# Altium project pca10184.PrjPcb (part 2 of 5)

## Sheet pca10184_power_supply.SchDoc: =ProductName + ' - Power Supply'
size A3; Author: GETR; CompanyName: Nordic Semiconductor; DrawnBy: GETR; DocumentNumber: 6; Revision: 0.7.0; SheetNumber: 6; SheetTotal: 9
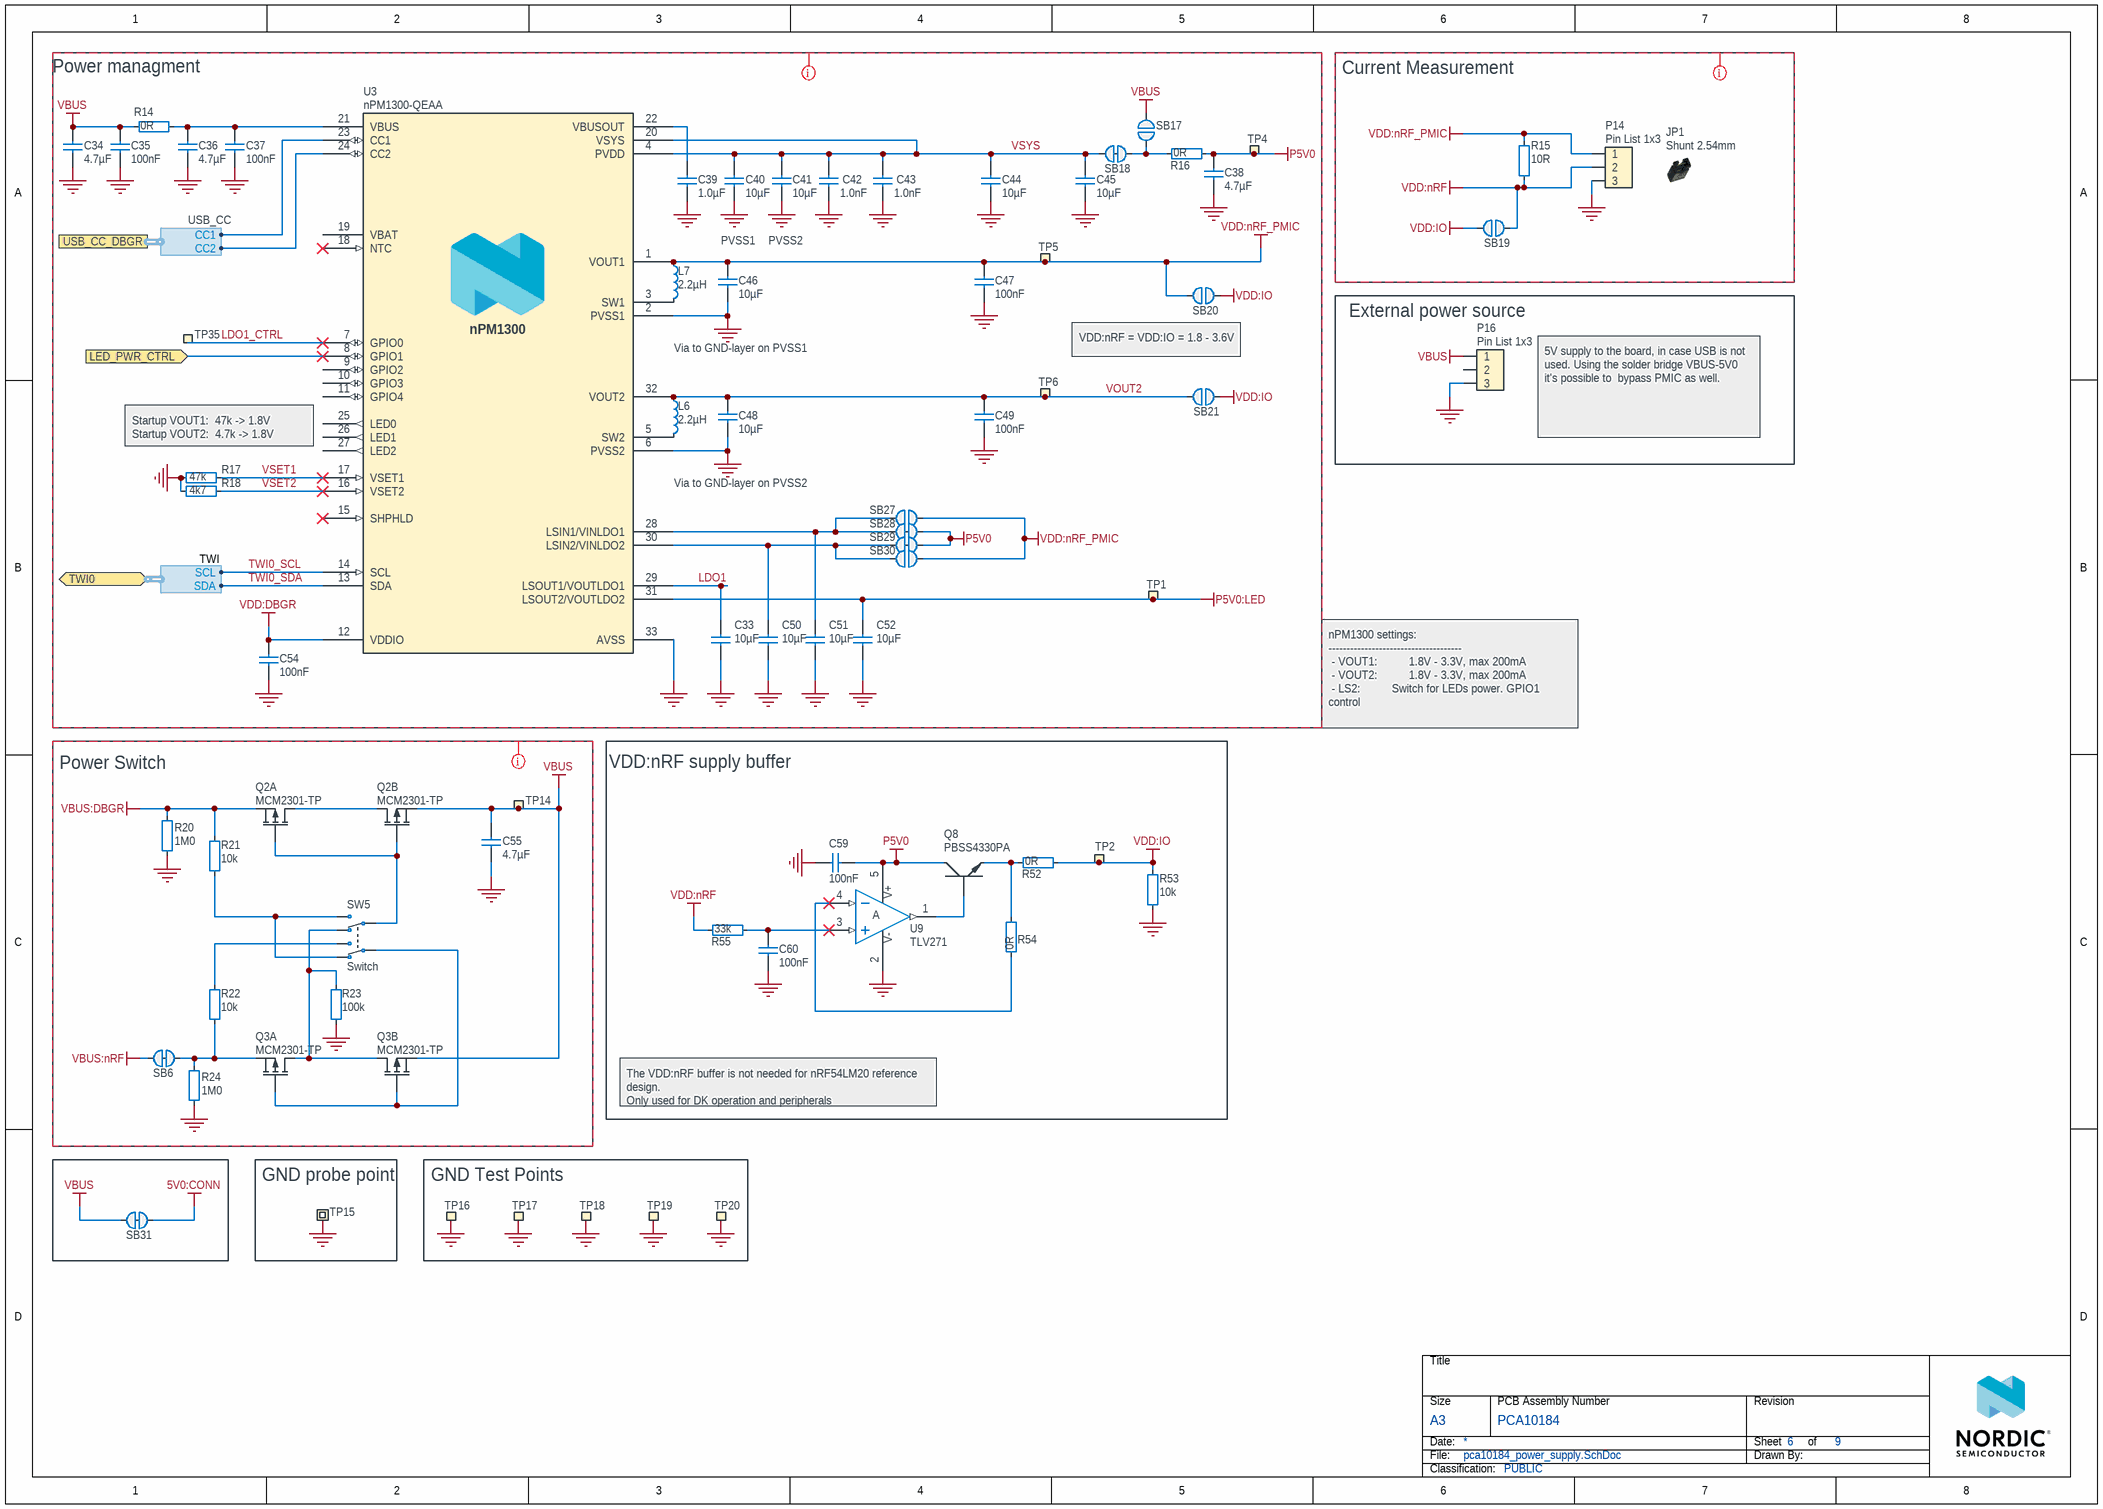
[diagram p2: pca10184_power_supply.SchDoc]

### Parts
C33  10µF  [CAPC1608X06L]
C34  4.7µF  [CAPC1005X04L_C2]
C35  100nF  [CAPC0603X03L_C]
C36  4.7µF  [CAPC1005X04L_C2]
C37  100nF  [CAPC0603X03L_C]
C38  4.7µF  [CAPC1005X04L_C2]
C39  1.0µF  [CAPC1005X04L]
C40  10µF  [CAPC1608X06L]
C41  10µF  [CAPC1608X06L]
C42  1.0nF  [CAPC0603X03L_C]
C43  1.0nF  [CAPC0603X03L_C]
C44  10µF  [CAPC1608X06L]
C45  10µF  [CAPC1608X06L]
C46  10µF  [CAPC1608X06L]
C47  100nF  [CAPC0603X03L_C]
C48  10µF  [CAPC1608X06L]
C49  100nF  [CAPC0603X03L_C]
C50  10µF  [CAPC1608X06L]
C51  10µF  [CAPC1608X06L]
C52  10µF  [CAPC1608X06L]
C54  100nF  [CAPC0603X03L_C]
C55  4.7µF  [CAPC1608X06L]
C59  100nF  [CAPC0603X03L_C]
C60  100nF  [CAPC0603X03L_C]
JP1  Shunt 2.54mm  [Shunt_2.54mm_Vertical]
L6  2.2µH  [INDC2016X10N]
L7  2.2µH  [INDC2016X10N]
P14  Pin List 1x3  [LIST_1x3_SMD]
P16  Pin List 1x3  [LIST_1x3_SMD]
Q2  MCM2301-TP  [DFN65P200X200X80_HS-6N]  (parts A,B of 2)
Q3  MCM2301-TP  [DFN65P200X200X80_HS-6N]  (parts A,B of 2)
Q8  PBSS4330PA  [DFN105P200X65-3N_v2]
R14  0R  [RESC1005X04L]
R15  10R  [RESC1005X04L]
R16  0R  [RESC1005X04L]
R17  47k  [RESC0603X03L_C]
R18  4k7  [RESC0603X03L_C]
R20  1M0  [RESC0603X03L_C]
R21  10k  [RESC0603X03L_C]
R22  10k  [RESC0603X03L_C]
R23  100k  [RESC0603X03L_C]
R24  1M0  [RESC0603X03L_C]
R52  0R  [RESC0603X03L_C]
R53  10k  [RESC0603X03L_C]
R54  0R  [RESC0603X03L_C]
R55  33k  [RESC0603X03L_C]
SB6  Solderbridge  [Solderbridge_Shorted_Power]  (value not drawn)  (net tie, no BOM)
SB17  Solderbridge  [Solderbridge]  (value not drawn)  (no BOM)
SB18  Solderbridge  [Solderbridge_Shorted_Power]  (value not drawn)  (net tie, no BOM)
SB19  Solderbridge  [Solderbridge]  (value not drawn)  (no BOM)
SB20  Solderbridge  [Solderbridge]  (value not drawn)  (no BOM)
SB21  Solderbridge  [Solderbridge]  (value not drawn)  (no BOM)
SB27  Solderbridge  [Solderbridge]  (value not drawn)  (no BOM)
SB28  Solderbridge  [Solderbridge_Shorted]  (value not drawn)  (net tie, no BOM)
SB29  Solderbridge  [Solderbridge_Shorted]  (value not drawn)  (net tie, no BOM)
SB30  Solderbridge  [Solderbridge]  (value not drawn)  (no BOM)
SB31  Solderbridge  [Solderbridge_Shorted_Power]  (value not drawn)  (net tie, no BOM)
SW5  Switch  [JS102011JAQN]
TP1  Ø1.5mm,SMD  [TP_SMD_D1.5mm]  (value not drawn)  (no BOM)
TP2  Ø1.5mm,SMD  [TP_SMD_D1.5mm]  (value not drawn)  (no BOM)
TP4  Ø1.5mm,SMD  [TP_SMD_D1.5mm]  (value not drawn)  (no BOM)
TP5  Ø1.5mm,SMD  [TP_SMD_D1.5mm]  (value not drawn)  (no BOM)
TP6  Ø1.5mm,SMD  [TP_SMD_D1.5mm]  (value not drawn)  (no BOM)
TP14  Ø1.5mm,SMD  [TP_SMD_D1.5mm]  (value not drawn)  (no BOM)
TP15  TP  [S1751]  (value not drawn)
TP16  Ø1.5mm,SMD  [TP_SMD_D1.5mm]  (value not drawn)  (no BOM)
TP17  Ø1.5mm,SMD  [TP_SMD_D1.5mm]  (value not drawn)  (no BOM)
TP18  Ø1.5mm,SMD  [TP_SMD_D1.5mm]  (value not drawn)  (no BOM)
TP19  Ø1.5mm,SMD  [TP_SMD_D1.5mm]  (value not drawn)  (no BOM)
TP20  Ø1.5mm,SMD  [TP_SMD_D1.5mm]  (value not drawn)  (no BOM)
TP35  Ø0.7mm,SMD  [TP_SMD_D0.7mm]  (value not drawn)  (no BOM)
U3  nPM1300-QEAA  [Nordic_QFN50P500X500X90-33N]
U9  TLV271  [SOT95P280X145-5N]

### Blocks framed on the sheet
Power managment: C33-C52 C54 L6 L7 R14 R16-R18 SB17 SB18 SB20 SB21 SB27-SB30 TP1 TP4-TP6 TP35 U3
Current Measurement: JP1 P14 R15 SB19
External power source: P16
Power Switch: C55 Q2 Q3 R20-R24 SB6 SW5 TP14
VDD:nRF supply buffer: C59 C60 Q8 R52-R55 TP2 U9
GND probe point: TP15
GND Test Points: TP16-TP20

### Ports
LED_PWR_CTRL (in), TWI0 (bidir, harness TWI), USB_CC_DBGR (harness USB_CC)

### Harnesses
USB_CC: CC2, CC1
TWI: SCL, SDA

### Nets
5V0:CONN: SB31.1
GND: C33.1 C34.1 C35.1 C36.1 C37.1 C38.1 C39.1 C40.1 C41.1 C42.1 C43.1 C44.1 C45.1 C46.1 C47.1 C48.1 C49.1 C50.1 C51.1 C52.1 C54.2 C55.1 C59.2 C60.2 P14.3 P16.3 R17.2 R18.2 R20.2 R23.2 R24.2 R53.1 TP15.1 TP16.1 TP17.1 TP18.1 TP19.1 TP20.1 U3.2(PVSS1) U3.6(PVSS2) U3.33(AVSS) U9.2(VSS)
P5V0: C38.2 C59.1 Q8.3(C) R16.2 SB28.1 SB29.1 TP4.1 U9.5(VDD)
P5V0:LED: C52.2 TP1.1 U3.31(LSOUT2/VOUTLDO2)
VBUS: C34.2 C35.2 C55.2 P16.1 Q2.4(S2) Q3.4(S2) R14.1 SB17.1 SB31.2 TP14.1
VBUS:DBGR: Q2.1(S1) R20.1 R21.1
VBUS:nRF: SB6.2
VDD:DBGR: C54.1 U3.12(VDDIO)
VDD:IO: R52.2 R53.2 SB19.1 SB20.1 SB21.1 TP2.1
VDD:nRF: P14.2 R15.1 R55.1 SB19.2
VDD:nRF_PMIC: C46.2 C47.2 L7.1 P14.1 R15.2 SB20.2 SB27.1 SB30.1 TP5.1 U3.1(VOUT1)
LDO1: C33.2 U3.29(LSOUT1/VOUTLDO1)
LDO1_CTRL: TP35.1 U3.7(GPIO0)
LED_PWR_CTRL: U3.8(GPIO1) ; port LED_PWR_CTRL
TWI0_SCL: U3.14(SCL) ; port TWI0.SCL
TWI0_SDA: U3.13(SDA) ; port TWI0.SDA
VOUT2: C48.2 C49.2 L6.1 SB21.2 TP6.1 U3.32(VOUT2)
VSET1: R17.1 U3.17(VSET1)
VSET2: R18.1 U3.16(VSET2)
VSYS: C40.2 C41.2 C42.2 C43.2 C44.2 C45.2 SB18.2 U3.4(PVDD) U3.20(VSYS)
NetC36_2: C36.2 C37.2 R14.2 U3.21(VBUS)
NetC39_2: C39.2 U3.22(VBUSOUT)
NetC50_2: C50.2 SB29.2 SB30.2 U3.30(LSIN2/VINLDO2)
NetC51_2: C51.2 SB27.2 SB28.2 U3.28(LSIN1/VINLDO1)
NetC60_1: C60.1 R55.2 U9.3(IN+)
NetJ4_A5: U3.23(CC1) ; port USB_CC_DBGR.CC1
NetJ4_B5: U3.24(CC2) ; port USB_CC_DBGR.CC2
NetL6_2: L6.2 U3.5(SW2)
NetL7_2: L7.2 U3.3(SW1)
NetQ2_2: Q2.2(G1) Q2.5(G2) SW5.5(COM-2)
NetQ2_3: Q2.3(D2) Q2.6(D1)
NetQ3_1: Q3.1(S1) R22.2 R24.1 SB6.1
NetQ3_2: Q3.2(G1) Q3.5(G2) SW5.2(COM-1)
NetQ3_3: Q3.3(D2) Q3.6(D1) R23.1 SW5.6(N.C-2)
NetQ8_1: Q8.1(B) U9.1(OUT)
NetQ8_2: Q8.2(E) R52.1 R54.2
NetR16_1: R16.1 SB17.2 SB18.1
NetR21_2: R21.2 SW5.3(N.C-1) SW5.4(N.O-2)
NetR22_1: R22.1 SW5.1(N.O-1)
NetR54_1: R54.1 U9.4(IN-)

Not connected (* = marked no-connect by the designer): P16 2; U3 9(GPIO2) 10(GPIO3) 11(GPIO4) 15(SHPHLD)* 18(NTC)* 19(VBAT) 25(LED0) 26(LED1) 27(LED2)

### Layout directives
CompClassName: nPM1300: GND, LDO1, LDO1_CTRL, P5V0, P5V0:LED, TWI0_SCL, TWI0_SDA, VBUS, VDD:DBGR, VDD:IO, VDD:nRF_PMIC, VOUT2, VSET1, VSET2, VSYS
CompClassName: Current measurments: GND, VDD:IO, VDD:nRF, VDD:nRF_PMIC
CompClassName: Power Switch: GND, VBUS, VBUS:DBGR, VBUS:nRF

### Notes on the sheet
- PVSS1
- PVSS2
- Via to GND-layer on PVSS1
- VDD:nRF = VDD:IO = 1.8 - 3.6V
- Startup VOUT1:  47k -> 1.8V
  Startup VOUT2:  4.7k -> 1.8V
- 5V supply to the board, in case USB is not used. Using the solder bridge VBUS-5V0 it's possible to  bypass PMIC as well.
- Via to GND-layer on PVSS2
- nPM1300 settings:
  -------------------------------------
  - VOUT1:          1.8V - 3.3V, max 200mA
  - VOUT2:          1.8V - 3.3V, max 200mA
  - LS2:	         Switch for LEDs power. GPIO1 control
  VSYS current limit: 900mA
- The VDD:nRF buffer is not needed for nRF54LM20 reference design.
  Only used for DK operation and peripherals
- Title
- Size
- Date:
- File:
- A3
- PCB Assembly Number
- Sheet
- Drawn By:
- Revision
- of
- Classification:
- (in symbol nPM1300-QEAA) nPM1300
- (in symbol TLV271CW5-7) V+; A; V-

### Library data of the parts
C33 C50-C52 = C0603-10µ-10V-X5R: Capacitor, Ceramic, X5R, ±20%, 10V; Manufacturer: N.A.; Part number Norautron: 262085341; Part number NEMS: 100200481; Component Status: Active; Pad Count: 2; Part Number: C0603-10µ-10V-X5R; PartId: 100200481; Component Class: Capacitors; Author: rubr; Manufacturer Part Number: N.A.; ComponentLink1URL: N.A.; ComponentLink1Description: Datasheet; ComponentLink2URL: N.A.; ComponentLink2Description: Supplier link; HelpURL: N.A.; LatestRevisionDate: 2021-07-22; Published: 2021-07-22; Footprint Doc: 0603; Value: 10µF; Note: 10V; Supplier 1: N.A.; Supplier Part Number 1: N.A.; Supplier 2: N.A.; Supplier Part Number 2: N.A.; Artikkelnr Noca: N.A.; Part number IPS: N.A.
C34 C36 C38 = C0402-4µ7-10V-X5R-GRM155R61A475MEAAD: Capacitor, X5R, ±20%, 10V; Manufacturer: Murata; Part number NEMS: 100200549, 100200415; Component Status: Active; Pad Count: 2; Artikkelnr Noca: N.A.; Part Number: C0402-4µ7-10V-X5R-GRM155R61A475MEAAD; PartId: 100200549; Component Class: Capacitors; Author: rubr; Manufacturer Part Number: GRM155R61A475MEAA; ComponentLink1URL: https://search.murata.co.jp/Ceramy/image/img/A01X/G101/ENG/GRM155R61A475MEAA-01.pdf; ComponentLink1Description: Datasheet; ComponentLink2URL: N.A.; ComponentLink2Description: Supplier link; HelpURL: https://www.murata.com/en-us/products/productdetail?partno=GRM155R61A475MEAA%23; LatestRevisionDate: 2023-03-22; Published: 2023-03-22; Footprint Doc: 0402; Value: 4.7µF; Note: 10V; Supplier 1: Digi-Key; Supplier Part Number 1: 490-14306-1-ND; Supplier 2: N.A.; Supplier Part Number 2: N.A.; Part number IPS: N.A.; Part number Norautron: N.A.
C35 C37 C47 C49 C54 = C0201-100n: Capacitor, X5R, ±10%, 100nF, 16V; Manufacturer: N.A.; Part number IPS: 00000001248, 00000002505; Part number Norautron: 262071862; Part number NEMS: 100200078; Pad Count: 2; Component Status: Active; Part Number: C0201-100n; Manufacturer Part Number: N.A.; ComponentLink1URL: N.A.; ComponentLink1Description: Datasheet; ComponentLink2URL: N.A.; ComponentLink2Description: Supplier link; HelpURL: N.A.; Footprint Doc: 0201; LatestRevisionDate: 2024-06-27; Published: 2014-11-13; Value: 100nF; Note: 16V; Supplier 1: N.A.; Supplier Part Number 1: N.A.; Supplier 2: N.A.; Supplier Part Number 2: N.A.; Artikkelnr Noca: N.A.; PartId: 100200078; Component Class: Capacitors; Author: rsk
C39 = C0402-1µ0-10V-X5R: Capacitor, Ceramic, X5R, ±10%, 10V; Manufacturer: N.A.; Part number NEMS: 100200482; Component Status: Active; Pad Count: 2; Part Number: C0402-1µ0-10V-X5R; PartId: 100200482; Component Class: Capacitors; Author: rubr; Manufacturer Part Number: N.A.; ComponentLink1URL: N.A.; ComponentLink1Description: Datasheet; ComponentLink2URL: N.A.; ComponentLink2Description: Supplier link; HelpURL: N.A.; LatestRevisionDate: 2021-07-22; Published: 2021-07-22; Footprint Doc: 0402; Value: 1.0µF; Note: 10V; Supplier 1: N.A.; Supplier Part Number 1: N.A.; Supplier 2: N.A.; Supplier Part Number 2: N.A.; Artikkelnr Noca: N.A.; Part number IPS: N.A.; Part number Norautron: N.A.
C40 C41 C44-C46 C48 = C0603-10µ-10V-X7T-GRM188D71A106MA73: Capacitor, X7T, ±20%, 10V; Manufacturer: Murata; Manufacturer Part Number: GRM188D71A106MA73D; Part number IPS: 00000004696; Part number NEMS: 100200414; Component Status: Active; Pad Count: 2; Note: 10VDC; Artikkelnr Noca: N.A.; Part Number: C0603-10µ-10V-X7T-GRM188D71A106MA73; PartId: 100200414; Component Class: Capacitors; Author: rsk; ComponentLink1URL: N.A.; ComponentLink1Description: Datasheet; ComponentLink2URL: N.A.; ComponentLink2Description: Supplier link; HelpURL: https://no.mouser.com/datasheet/2/281/murata_03052018_GRM_Series_1-1310166.pdf; LatestRevisionDate: 2021-07-22; Published: 2018-09-11; Footprint Doc: 0603; Value: 10µF; Supplier 1: Digi-Key; Supplier Part Number 1: 490-7200-1-ND; Supplier 2: Mouser; Supplier Part Number 2: 81-GRM188D71A106MA3D; Part number Norautron: N.A.
C42 C43 = C0201-1n0: Capacitor, X7R, ±10%, 25V; Manufacturer: N.A.; Part number IPS: 00000003206; Part number NEMS: 100200056; Component Status: Active; Pad Count: 2; Note: 16V; Part Number: C0201-1n0; PartId: 100200056; Component Class: Capacitors; Author: rsk; Manufacturer Part Number: N.A.; ComponentLink1URL: N.A.; ComponentLink1Description: Datasheet; ComponentLink2URL: N.A.; ComponentLink2Description: Supplier link; HelpURL: N.A.; LatestRevisionDate: 2020-10-13; Published: 2014-11-13; Footprint Doc: 0201; Value: 1.0nF; Supplier 1: N.A.; Supplier Part Number 1: N.A.; Supplier 2: N.A.; Supplier Part Number 2: N.A.; Artikkelnr Noca: N.A.; Part number Norautron: N.A.
C55 = C0603-4µ7-25V-X5R: Capacitor, X5R, ±10%, 25V; Manufacturer: Murata; Manufacturer Part Number: GRM188R61E475KE11D; Part number NEMS: 100200352; Component Status: Active; Pad Count: 2; Artikkelnr Noca: N.A.; Part Number: C0603-4µ7-25V-X5R; PartId: 100200352; Component Class: Capacitors; Author: rsk; ComponentLink1URL: https://www.murata.com/~/media/webrenewal/support/library/catalog/products/capacitor/mlcc/c02e.ashx?la=en-us; ComponentLink1Description: Datasheet; ComponentLink2URL: https://www.digikey.com/product-detail/en/murata-electronics-north-america/GRM188R61E475KE11D/490-7203-1-ND/3900450; ComponentLink2Description: Supplier link; HelpURL: https://www.murata.com/~/media/webrenewal/support/library/catalog/products/capacitor/mlcc/c02e.ashx?la=en-us; LatestRevisionDate: 2019-06-11; Published: 2019-06-11; Footprint Doc: 0603; Value: 4.7µF; Note: 25V; Supplier 1: Digi-Key; Supplier Part Number 1: 490-7203-1-ND; Supplier 2: N.A.; Supplier Part Number 2: N.A.; Part number IPS: N.A.; Part number Norautron: N.A.
C59 C60 = C0201-100n: Capacitor, X5R, ±10%; Manufacturer: N.A.; Part number IPS: 00000001248, 00000002505; Part number Norautron: 262071862; Part number NEMS: 100200078; Pad Count: 2; Note: 16V; Component Status: Active; Part Number: C0201-100n; LatestRevisionDate: 2017-11-09; Published: 2014-11-13; Value: 100nF; Footprint Doc: 0201; Component Class: Capacitors; PartId: 100200078; Author: rsk; Manufacturer Part Number: N.A.; ComponentLink1URL: N.A.; ComponentLink1Description: Datasheet; ComponentLink2URL: N.A.; ComponentLink2Description: Supplier link; HelpURL: N.A.; Supplier 1: N.A.; Supplier Part Number 1: N.A.; Supplier 2: N.A.; Supplier Part Number 2: N.A.; Artikkelnr Noca: N.A.
JP1 = SHUNT JUMPER 2.54mm Black Vertical: Shunt Jumper 2.54mm Black, open top; Manufacturer: WCON; Manufacturer Part Number: 3710-6001OS0B05; Part number NEMS: 100500728; Pad Count: 2; Note: N.A.; Component Status: Active; System: Connector; Part Number: SHUNT JUMPER 2.54mm Black Vertical; PartId: 100500752; Component Class: Connectors; Author: masi; ComponentLink1URL: N.A.; ComponentLink1Description: Datasheet; ComponentLink2URL: N.A.; ComponentLink2Description: Supplier link; HelpURL: N.A.; Footprint Doc: SHUNT JUMPER 2.54mm; LatestRevisionDate: 2024-08-02; Published: 2022-07-01; Value: Shunt 2.54mm; Supplier 1: Cabcon; Supplier Part Number 1: 3710-6001OS0B05; Supplier 2: N.A.; Supplier Part Number 2: N.A.; Artikkelnr Noca: N.A.; Part number IPS: N.A.; Part number Norautron: N.A.
L6 L7 = L0806-2µ2-2500mA-73mOhm-CIGT201610EH2R2MNE: Inductor, Irms=2.5A, Isat=2.9A, ±20%, DCR=73mΩ; Manufacturer: Samsung Electro-Mechanics America; Part number Norautron: 26521789; Part number NEMS: 100300400; Component Status: Active; Pad Count: 2; Note: Unshielded Thin Film Inductor; Artikkelnr Noca: N.A.; Part Number: L0806-2µ2-2500mA-73mOhm-CIGT201610EH2R2MNE; PartId: 100300400; Component Class: Inductors; Author: rsk; Manufacturer Part Number: CIGT201610EH2R2MNE; ComponentLink1URL: https://media.digikey.com/pdf/Data%20Sheets/Samsung%20PDFs/CIGT201610EH2R2MNE_Spec.pdf; ComponentLink1Description: Datasheet; ComponentLink2URL: https://www.digikey.com/en/products/detail/samsung-electro-mechanics/CIGT201610EH2R2MNE/7041223?s=N4IgTCBcDaIMIEkDiAVMAGAjANk%2BgogBJgBKYAsgHL4gC6AvkA; ComponentLink2Description: Supplier link; HelpURL: http://product.samsungsem.com/pi/CIGT201610EH2R2MN.do; LatestRevisionDate: 2022-09-07; Published: 2021-02-03; Footprint Doc: 0806; Value: 2.2µH; Supplier 1: Digi-Key; Supplier Part Number 1: 1276-6901-1-ND; Supplier 2: Mouser; Supplier Part Number 2: 187-CIGT201610EH2R2M; Part number IPS: N.A.
P14 P16 = Pin List 1x3 SMD: Pin List 1x3, 2.54mm (100mil), SMD; Manufacturer: WCON; Manufacturer Part Number: 1125-1103S0M116CR04; Part number Norautron: 26470016; Part number NEMS: 100500306; Note: N.A.; Pad Count: 3; Component Status: Active; System: Connector; Part Number: Pin List 1x3 SMD; Footprint Doc: LIST_1x3_SMD; LatestRevisionDate: 2021-09-24; Published: 2013-10-21; Value: Pin List 1x3; Artikkelnr Noca: N.A.; ComponentLink1URL: N.A.; ComponentLink1Description: Datasheet; ComponentLink2URL: N.A.; ComponentLink2Description: Supplier link; HelpURL: N.A.; Part number IPS: N.A.; Supplier 1: Cabcon; Supplier Part Number 1: 1125-1103S0M116CR04; Supplier 2: Samtec; Supplier Part Number 2: TSM-103-01-L-SV-P-TR; Component Class: Connectors; PartId: 100500306; Author: rsk
Q2 Q3 = MCM2301-TP: Dual P-Channel MOFET, 3.8A, 90mOhm max, 1.4W; Manufacturer: Micro Commercial Components; Part number NEMS: 101300199; Component Status: Active; Pad Count: 6; Note: N.A.; Part Number: MCM2301-TP; PartId: 101300199; Component Class: Semiconductors; Author: rubr; Manufacturer Part Number: MCM2301-TP; ComponentLink1URL: https://www.mccsemi.com/pdf/Products/MCM2301(DFN2020-6L).pdf; ComponentLink1Description: Datasheet; ComponentLink2URL: https://www.digikey.com/en/products/detail/micro-commercial-co/MCM2301-TP/9655971; ComponentLink2Description: Supplier link; HelpURL: https://www.mccsemi.com/product-detail/MCM2301; LatestRevisionDate: 2022-12-27; Published: 2022-12-27; Footprint Doc: VDFN-6; Value: MCM2301-TP; Supplier 1: Digi-Key; Supplier Part Number 1: MCM2301-TPMSCT-ND; Supplier 2: Mouser; Supplier Part Number 2: 833-MCM2301-TP; Artikkelnr Noca: N.A.; Part number IPS: N.A.; Part number Norautron: N.A.
Q8 = PBSS4330PA,115: 30V, 3A, 2.1W, G=270, NPN Transistor; Manufacturer: Nexperia; Part number NEMS: 101300184; Component Status: Active; Pad Count: 3; Note: N.A.; Part Number: PBSS4330PA,115; PartId: 101300184; Component Class: Semiconductors; Author: rubr; Manufacturer Part Number: PBSS4330PA,115; ComponentLink1URL: https://assets.nexperia.com/documents/data-sheet/PBSS4330PA.pdf; ComponentLink1Description: Datasheet; ComponentLink2URL: https://www.digikey.com/en/products/detail/nexperia-usa-inc/PBSS4330PA-115/2296330; ComponentLink2Description: Supplier link; HelpURL: https://www.nexperia.com/products/bipolar-transistors/general-purpose-and-low-vcesat-bipolar-transistors/single-bipolar-transistors/single-bipolar-transistors-100-v/PBSS4330PA.html; LatestRevisionDate: 2021-06-03; Published: 2021-06-03; Footprint Doc: HUSON-3 (2x2); Value: PBSS4330PA; Supplier 1: Digi-Key; Supplier Part Number 1: 1727-5112-1-ND‎; Supplier 2: N.A.; Supplier Part Number 2: N.A.; Artikkelnr Noca: N.A.; Part number IPS: N.A.; Part number Norautron: N.A.
R14 R16 = R0402-0R: Resistor, ±5%, 0.063W; Manufacturer: N.A.; Part number IPS: 00000007128; Part number NEMS: 100100109; Component Status: Active; Pad Count: 2; Note: Chip Res 5%; Artikkelnr Noca: 27049000; Part Number: R0402-0R; PartId: 100100109; Component Class: Resistors; Author: rsk; Manufacturer Part Number: N.A.; ComponentLink1URL: N.A.; ComponentLink1Description: Datasheet; ComponentLink2URL: N.A.; ComponentLink2Description: Supplier link; HelpURL: N.A.; LatestRevisionDate: 2009-11-23; Published: 2009-05-08; Footprint Doc: 0402; Value: 0R; Supplier 1: Farnell; Supplier Part Number 1: 146-9661; Supplier 2: N.A.; Supplier Part Number 2: N.A.; Part number Norautron: N.A.
R15 = R0402-10R: Resistor, ±1%, 0.063W; Manufacturer: N.A.; Part number NEMS: 100100126; Component Status: Active; Pad Count: 2; Note: Chip Res 1%; Artikkelnr Noca: 27049025; Part Number: R0402-10R; PartId: 100100126; Component Class: Resistors; Author: rsk; Manufacturer Part Number: N.A.; ComponentLink1URL: N.A.; ComponentLink1Description: Datasheet; ComponentLink2URL: N.A.; ComponentLink2Description: Supplier link; HelpURL: N.A.; LatestRevisionDate: 2009-11-23; Published: 2009-05-08; Footprint Doc: 0402; Value: 10R; Supplier 1: Farnell; Supplier Part Number 1: 173-8824; Supplier 2: N.A.; Supplier Part Number 2: N.A.; Part number IPS: N.A.; Part number Norautron: N.A.
R17 = R0201-47k: Resistor, ±1%, 0.05W; Manufacturer: N.A.; Part number IPS: 00000001423; Part number NEMS: 100100076; Component Status: Active; Pad Count: 2; Note: Chip Res 1%; Part Number: R0201-47k; PartId: 100100076; Component Class: Resistors; Author: rsk; Manufacturer Part Number: N.A.; ComponentLink1URL: N.A.; ComponentLink1Description: Datasheet; ComponentLink2URL: N.A.; ComponentLink2Description: Supplier link; HelpURL: N.A.; LatestRevisionDate: 2014-11-13; Published: 2014-11-13; Footprint Doc: 0201; Value: 47k; Supplier 1: N.A.; Supplier Part Number 1: N.A.; Supplier 2: N.A.; Supplier Part Number 2: N.A.; Artikkelnr Noca: N.A.; Part number Norautron: N.A.
R18 = R0201-4k7: Resistor, ±1%, 0.05W; Manufacturer: N.A.; Part number IPS: 00000001706; Part number NEMS: 100100061; Component Status: Active; Pad Count: 2; Note: Chip Res 1%; Part Number: R0201-4k7; PartId: 100100061; Component Class: Resistors; Author: rsk; Manufacturer Part Number: N.A.; ComponentLink1URL: N.A.; ComponentLink1Description: Datasheet; ComponentLink2URL: N.A.; ComponentLink2Description: Supplier link; HelpURL: N.A.; LatestRevisionDate: 2014-11-13; Published: 2014-11-13; Footprint Doc: 0201; Value: 4k7; Supplier 1: N.A.; Supplier Part Number 1: N.A.; Supplier 2: N.A.; Supplier Part Number 2: N.A.; Artikkelnr Noca: N.A.; Part number Norautron: N.A.
R20 R24 = R0201-1M0: Resistor, ±1%, 0.05W; Manufacturer: N.A.; Part number IPS: 00000001418; Part number Norautron: 26107108; Part number NEMS: 100100093; Note: Chip Res 1%; Pad Count: 2; Component Status: Active; Part Number: R0201-1M0; Manufacturer Part Number: N.A.; LatestRevisionDate: 2014-11-13; Published: 2014-11-13; Value: 1M0; Artikkelnr Noca: N.A.; Footprint Doc: 0201; ComponentLink1URL: N.A.; ComponentLink1Description: Datasheet; ComponentLink2URL: N.A.; ComponentLink2Description: Supplier link; HelpURL: N.A.; Supplier 1: N.A.; Supplier Part Number 1: N.A.; Supplier 2: N.A.; Supplier Part Number 2: N.A.; Component Class: Resistors; PartId: 100100093; Author: rsk
R21 R22 = R0201-10k: Resistor, ±1%, 0.05W; Manufacturer: N.A.; Part number IPS: 00000001255; Part number Norautron: 26107101; Part number NEMS: 100100065; Note: Chip Res 1%; Pad Count: 2; Component Status: Active; Part Number: R0201-10k; Manufacturer Part Number: N.A.; LatestRevisionDate: 2014-11-13; Published: 2014-11-13; Value: 10k; Artikkelnr Noca: N.A.; Footprint Doc: 0201; ComponentLink1URL: N.A.; ComponentLink1Description: Datasheet; ComponentLink2URL: N.A.; ComponentLink2Description: Supplier link; HelpURL: N.A.; Supplier 1: N.A.; Supplier Part Number 1: N.A.; Supplier 2: N.A.; Supplier Part Number 2: N.A.; Component Class: Resistors; PartId: 100100065; Author: rsk
R23 = R0201-100k: Resistor, ±1%, 0.05W; Manufacturer: N.A.; Part number IPS: 00000001419; Part number Norautron: 26108487; Part number NEMS: 100100080; Note: Chip Res 1%; Pad Count: 2; Component Status: Active; Part Number: R0201-100k; Manufacturer Part Number: N.A.; LatestRevisionDate: 2014-11-13; Published: 2014-11-13; Value: 100k; Artikkelnr Noca: N.A.; Footprint Doc: 0201; ComponentLink1URL: N.A.; ComponentLink1Description: Datasheet; ComponentLink2URL: N.A.; ComponentLink2Description: Supplier link; HelpURL: N.A.; Supplier 1: N.A.; Supplier Part Number 1: N.A.; Supplier 2: N.A.; Supplier Part Number 2: N.A.; Component Class: Resistors; PartId: 100100080; Author: rsk
R52 R54 = R0201-0R: Resistor, ±5%, 0.05W; Manufacturer: N.A.; Part number IPS: 00000003245; Part number NEMS: 100100001; Component Status: Active; Pad Count: 2; Note: Chip Res 5%; Part Number: R0201-0R; PartId: 100100001; Component Class: Resistors; Author: rsk; Manufacturer Part Number: N.A.; ComponentLink1URL: N.A.; ComponentLink1Description: Datasheet; ComponentLink2URL: N.A.; ComponentLink2Description: Supplier link; HelpURL: N.A.; LatestRevisionDate: 2017-11-09; Published: 2014-11-13; Footprint Doc: 0201; Value: 0R; Supplier 1: N.A.; Supplier Part Number 1: N.A.; Supplier 2: N.A.; Supplier Part Number 2: N.A.; Artikkelnr Noca: N.A.; Part number Norautron: N.A.
R53 = R0201-10k: Resistor, ±1%, 0.05W; Manufacturer: N.A.; Part number IPS: 00000001255; Part number Norautron: 26107101; Part number NEMS: 100100065; Component Status: Active; Pad Count: 2; Note: Chip Res 1%; Part Number: R0201-10k; PartId: 100100065; Component Class: Resistors; Author: rsk; Manufacturer Part Number: N.A.; ComponentLink1URL: N.A.; ComponentLink1Description: Datasheet; ComponentLink2URL: N.A.; ComponentLink2Description: Supplier link; HelpURL: N.A.; LatestRevisionDate: 2014-11-13; Published: 2014-11-13; Footprint Doc: 0201; Value: 10k; Supplier 1: N.A.; Supplier Part Number 1: N.A.; Supplier 2: N.A.; Supplier Part Number 2: N.A.; Artikkelnr Noca: N.A.
R55 = R0201-33k: Resistor, ±1%, 0.05W; Manufacturer: N.A.; Part number IPS: 00000001708; Part number NEMS: 100100073; Component Status: Active; Pad Count: 2; Note: Chip Res 1%; Part Number: R0201-33k; PartId: 100100073; Component Class: Resistors; Author: rsk; Manufacturer Part Number: N.A.; ComponentLink1URL: N.A.; ComponentLink1Description: Datasheet; ComponentLink2URL: N.A.; ComponentLink2Description: Supplier link; HelpURL: N.A.; LatestRevisionDate: 2014-11-13; Published: 2014-11-13; Footprint Doc: 0201; Value: 33k; Supplier 1: N.A.; Supplier Part Number 1: N.A.; Supplier 2: N.A.; Supplier Part Number 2: N.A.; Artikkelnr Noca: N.A.; Part number Norautron: N.A.
SB6 SB18 SB31 = Solderbridge Shorted Power: Shorted Solderbridge Power; Manufacturer: N.A.; Part number NEMS: 100500460; Component Status: Active; Pad Count: 2; System: Connector; Part Number: Solderbridge Shorted Power; PartId: 100500460; Component Class: Connectors; Author: rsk; Manufacturer Part Number: N.A.; ComponentLink1URL: N.A.; ComponentLink1Description: Datasheet; ComponentLink2URL: N.A.; ComponentLink2Description: Supplier link; HelpURL: N.A.; LatestRevisionDate: 2012-08-07; Published: 2012-08-07; Footprint Doc: Solderbridge_Shorted_Power; Value: Solderbridge; Note: N.A.; Supplier 1: N.A.; Supplier Part Number 1: N.A.; Supplier 2: N.A.; Supplier Part Number 2: N.A.; Artikkelnr Noca: N.A.; Part number IPS: N.A.; Part number Norautron: N.A.
SB17 = Solderbridge: Manufacturer: N.A.; Part number NEMS: 100500458; Pad Count: 2; Component Status: Active; System: Connector; Part Number: Solderbridge; Manufacturer Part Number: N.A.; LatestRevisionDate: 2009-12-14; Published: 2009-12-14; Value: Solderbridge; Note: N.A.; Artikkelnr Noca: N.A.; Footprint Doc: Solderbridge; Part number IPS: N.A.; ComponentLink1URL: N.A.; ComponentLink1Description: Datasheet; ComponentLink2URL: N.A.; ComponentLink2Description: Supplier link; HelpURL: N.A.; Supplier 1: N.A.; Supplier Part Number 1: N.A.; Supplier 2: N.A.; Supplier Part Number 2: N.A.; Component Class: Connectors; PartId: 100500458; Author: rsk; Part number Norautron: N.A.
SB19-SB21 SB27 SB30 = Solderbridge: Manufacturer: N.A.; Part number NEMS: 100500458; Component Status: Active; Pad Count: 2; System: Connector; Part Number: Solderbridge; PartId: 100500458; Component Class: Connectors; Author: rsk; Manufacturer Part Number: N.A.; ComponentLink1URL: N.A.; ComponentLink1Description: Datasheet; ComponentLink2URL: N.A.; ComponentLink2Description: Supplier link; HelpURL: N.A.; LatestRevisionDate: 2009-12-14; Published: 2009-12-14; Footprint Doc: Solderbridge; Value: Solderbridge; Note: N.A.; Supplier 1: N.A.; Supplier Part Number 1: N.A.; Supplier 2: N.A.; Supplier Part Number 2: N.A.; Artikkelnr Noca: N.A.; Part number IPS: N.A.; Part number Norautron: N.A.
SB28 SB29 = Solderbridge Shorted: Shorted Solderbridge; Manufacturer: N.A.; Part number NEMS: 100500459; Component Status: Active; Pad Count: 2; System: Connector; Part Number: Solderbridge Shorted; PartId: 100500459; Component Class: Connectors; Author: rsk; Manufacturer Part Number: N.A.; ComponentLink1URL: N.A.; ComponentLink1Description: Datasheet; ComponentLink2URL: N.A.; ComponentLink2Description: Supplier link; HelpURL: N.A.; LatestRevisionDate: 2012-08-07; Published: 2012-08-07; Footprint Doc: Solderbridge_Shorted; Value: Solderbridge; Note: N.A.; Supplier 1: N.A.; Supplier Part Number 1: N.A.; Supplier 2: N.A.; Supplier Part Number 2: N.A.; Artikkelnr Noca: N.A.; Part number IPS: N.A.; Part number Norautron: N.A.
SW5 = Switch-Slide-RA-J-Lead-DPDT-8.5x3.5mm_C&K: SMD slide Switch (ON-ON); Manufacturer: C&K; Manufacturer Part Number: JS202011JAQN; Part number IPS: 00000007811; Part number NEMS: 101500037; Note: N.A.; Pad Count: 6; Component Status: Active; Part Number: Switch-Slide-RA-J-Lead-DPDT-8.5x3.5mm_C&K; Footprint Doc: Switch-Slide-RA-J-Lead-DPDT-8.5x3.5mm; LatestRevisionDate: 2017-02-01; Published: 2016-09-15; Value: Switch; Artikkelnr Noca: N.A.; ComponentLink1URL: N.A.; ComponentLink1Description: Datasheet; ComponentLink2URL: N.A.; ComponentLink2Description: Supplier link; HelpURL: http://www.ck-components.com/media/1422/js.pdf; Supplier 1: Digi-Key; Supplier Part Number 1: CKN10722CT-ND; Supplier 2: Mouser; Supplier Part Number 2: 611-JS202011JAQN; Author: rsk; Component Class: Switches; PartId: 101500037; Part number Norautron: N.A.
TP1 TP2 TP4-TP6 TP14 TP16-TP20 = TP_SMD_Ø1.5MM: 1.5mm circular SMD testpad; Manufacturer: Nordic Semiconductor; Manufacturer Part Number: N.A.; Part number NEMS: 100500477; Pad Count: 1; Component Status: Active; Part Number: TP_SMD_Ø1.5MM; ComponentLink1URL: N.A.; ComponentLink1Description: Datasheet; ComponentLink2URL: N.A.; ComponentLink2Description: Supplier link; HelpURL: N.A.; Footprint Doc: TP_SMD_Ø1.5mm; LatestRevisionDate: 2021-03-05; Published: 2016-06-02; Value: Ø1.5mm,SMD; Note: N.A.; Supplier 1: N.A.; Supplier Part Number 1: N.A.; Supplier 2: N.A.; Supplier Part Number 2: N.A.; Artikkelnr Noca: N.A.; Part number IPS: N.A.; Component Class: Connectors; PartId: 100500477; Author: rsk; Part number Norautron: N.A.
TP15 = TP - S1751-46R: PC TEST POINT TIN SMD L; Manufacturer: Harwin; Part number NEMS: 100500525; Component Status: Active; Pad Count: 1; Note: N.A.; Part Number: TP - S1751-46R; PartId: 100500525; Component Class: Connectors; Author: rsk; Manufacturer Part Number: S1751-46R; ComponentLink1URL: N.A.; ComponentLink1Description: Datasheet; ComponentLink2URL: N.A.; ComponentLink2Description: Supplier link; HelpURL: http://cdn.harwin.com/pdfs/S1751.pdf; LatestRevisionDate: 2015-05-29; Published: 2015-05-29; Footprint Doc: Harwin S1751-46R; Value: TP; Supplier 1: Digi-Key; Supplier Part Number 1: 952-1478-1-ND; Supplier 2: N.A.; Supplier Part Number 2: N.A.; Artikkelnr Noca: N.A.; Part number IPS: N.A.; Part number Norautron: N.A.
TP35 = TP_SMD_Ø0.7MM: 0.7mm circular SMD testpad; Manufacturer: Nordic Semiconductor; Manufacturer Part Number: N.A.; Part number NEMS: 100500474; Pad Count: 1; Component Status: Active; Part Number: TP_SMD_Ø0.7MM; ComponentLink1URL: N.A.; ComponentLink1Description: Datasheet; ComponentLink2URL: N.A.; ComponentLink2Description: Supplier link; HelpURL: N.A.; Footprint Doc: TP_SMD_Ø0.7mm; LatestRevisionDate: 2021-03-05; Published: 2017-12-14; Value: Ø0.7mm,SMD; Note: N.A.; Supplier 1: N.A.; Supplier Part Number 1: N.A.; Supplier 2: N.A.; Supplier Part Number 2: N.A.; Artikkelnr Noca: N.A.; Part number IPS: N.A.; Component Class: Connectors; PartId: 100500474; Author: rsk; Part number Norautron: N.A.
U3 = nPM1300-QEAA: Li-Ion/Li-Polymer USB-C battery charger with high efficiency buck regulators, LDOs or load switches, LED drivers, TWI and VBUSOUT; Manufacturer: Nordic Semiconductor; Part number NEMS: 102000291; Component Status: Active; Pad Count: 33; Note: N.A.; Part Number: nPM1300-QEAA; PartId: 102000291; Component Class: Nordic_Devices; Author: eisk; Manufacturer Part Number: nPM1300-QEAA; ComponentLink1URL: N.A.; ComponentLink1Description: Datasheet; ComponentLink2URL: N.A.; ComponentLink2Description: Supplier link; HelpURL: N.A.; LatestRevisionDate: 2023-05-25; Published: 2022-02-17; Footprint Doc: QFN-32; Value: nPM1300-QEAA; Supplier 1: Nordic Semiconductor; Supplier Part Number 1: nPM1300-QEAA; Supplier 2: N.A.; Supplier Part Number 2: N.A.; Artikkelnr Noca: N.A.; Part number IPS: N.A.; Part number Norautron: N.A.
U9 = TLV271CW5-7: Dual rail to rail CMOS Amplifier; Manufacturer: Diodes Incorporated; Part number NEMS: 101900398; Component Status: Active; Pad Count: 5; Note: N.A.; Part Number: TLV271CW5-7; PartId: 101900398; Component Class: Misc_ICs; Author: rsk; Manufacturer Part Number: TLV271CW5-7; ComponentLink1URL: N.A.; ComponentLink1Description: Datasheet; ComponentLink2URL: N.A.; ComponentLink2Description: Supplier link; HelpURL: http://www.diodes.com/_files/datasheets/TLV27x.pdf; LatestRevisionDate: 2016-04-05; Published: 2016-04-05; Footprint Doc: SOT-25; Value: TLV271; Supplier 1: Digi-Key; Supplier Part Number 1: TLV271CW5-7DICT-ND; Supplier 2: N.A.; Supplier Part Number 2: N.A.; Artikkelnr Noca: N.A.; Part number IPS: N.A.; Part number Norautron: N.A.